# EasyEDA Pro project ESC-Player_BackBoardV03.epro

# Schematic Schematic1_2
Board Name: BackBoardV03; Create Date: 2025-04-19; Page Name: P1; Project Name: PcpRpi; Schematic Name: Schematic1_2; Update Date: 2025-04-19; Company: 嘉立创EDA; Page Size: A4; Version: V1.0
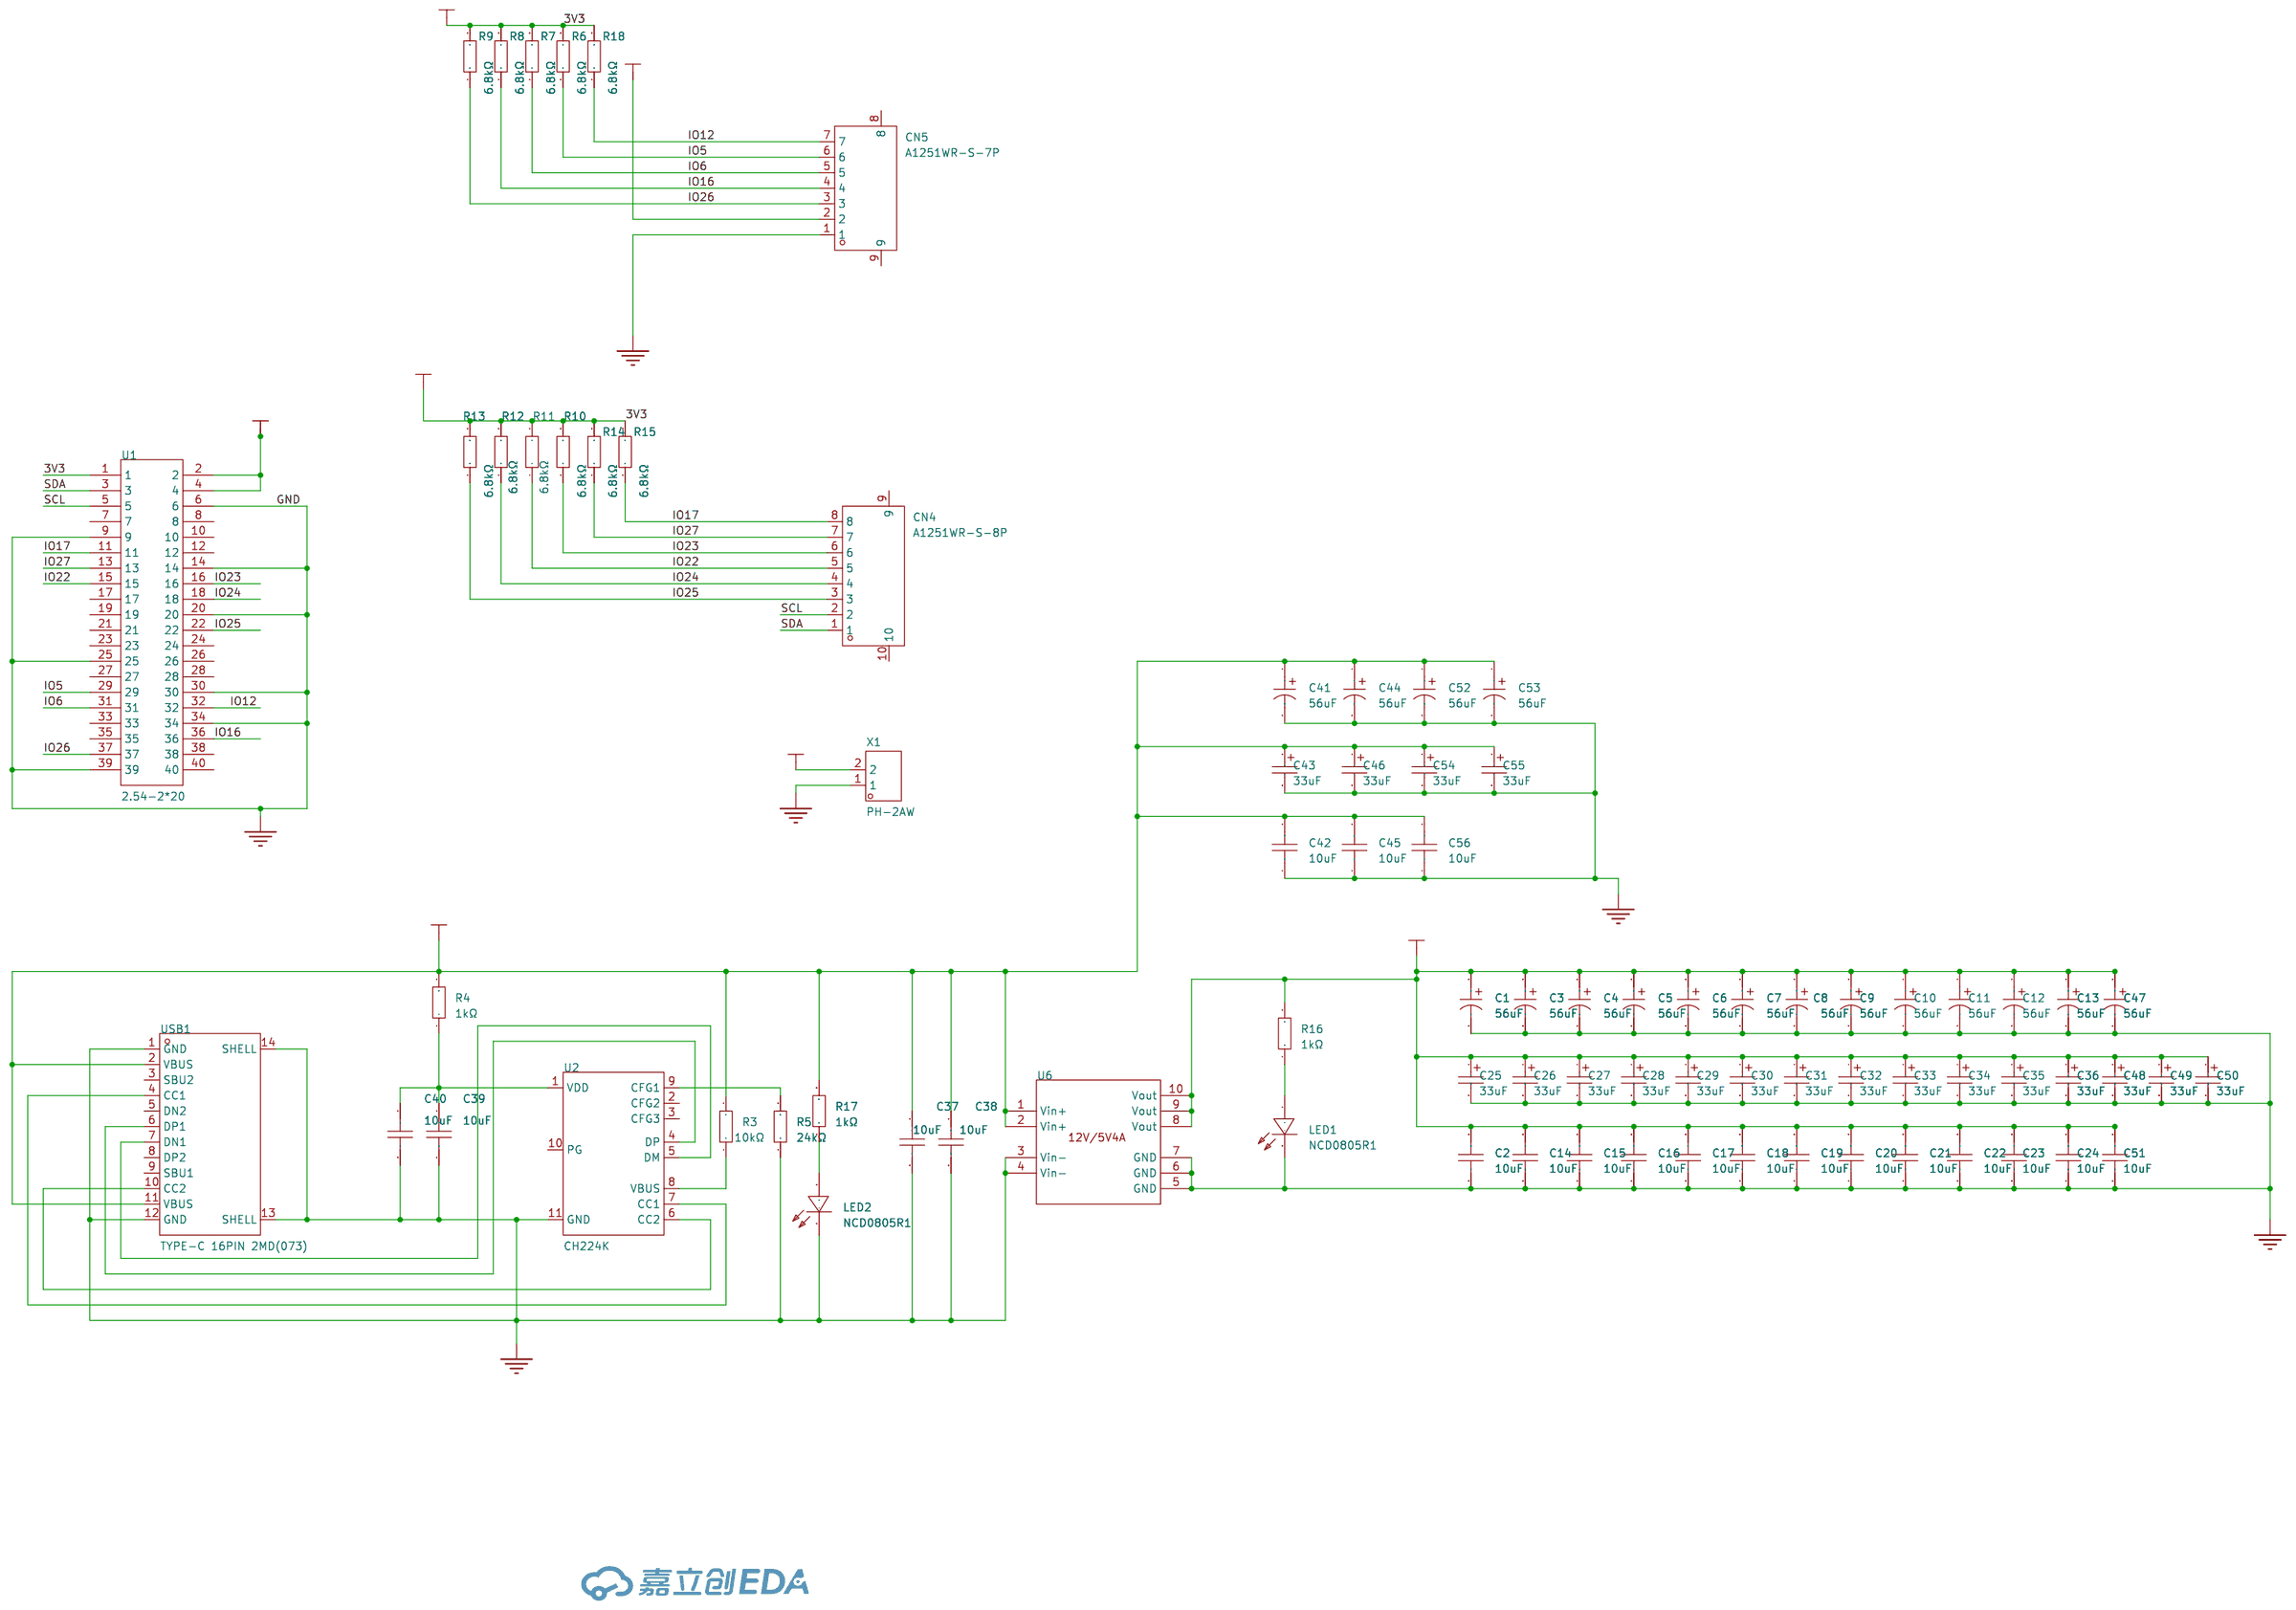
[diagram p0: schematic sheet]

## Parts
C1  56uF  [CAP-SMD_BD6.3-L6.6-W6.6-LS7.2-FD]
C2  10uF  [C1206]
C3  56uF  [CAP-SMD_BD6.3-L6.6-W6.6-LS7.2-FD]
C4  56uF  [CAP-SMD_BD6.3-L6.6-W6.6-LS7.2-FD]
C5  56uF  [CAP-SMD_BD6.3-L6.6-W6.6-LS7.2-FD]
C6  56uF  [CAP-SMD_BD6.3-L6.6-W6.6-LS7.2-FD]
C7  56uF  [CAP-SMD_BD6.3-L6.6-W6.6-LS7.2-FD]
C8  56uF  [CAP-SMD_BD6.3-L6.6-W6.6-LS7.2-FD]
C9  56uF  [CAP-SMD_BD6.3-L6.6-W6.6-LS7.2-FD]
C10  56uF  [CAP-SMD_BD6.3-L6.6-W6.6-LS7.2-FD]
C11  56uF  [CAP-SMD_BD6.3-L6.6-W6.6-LS7.2-FD]
C12  56uF  [CAP-SMD_BD6.3-L6.6-W6.6-LS7.2-FD]
C13  56uF  [CAP-SMD_BD6.3-L6.6-W6.6-LS7.2-FD]
C14  10uF  [C1206]
C15  10uF  [C1206]
C16  10uF  [C1206]
C17  10uF  [C1206]
C18  10uF  [C1206]
C19  10uF  [C1206]
C20  10uF  [C1206]
C21  10uF  [C1206]
C22  10uF  [C1206]
C23  10uF  [C1206]
C24  10uF  [C1206]
C25  33uF  [CAP-SMD_L3.5-W2.8-R-RD]
C26  33uF  [CAP-SMD_L3.5-W2.8-R-RD]
C27  33uF  [CAP-SMD_L3.5-W2.8-R-RD]
C28  33uF  [CAP-SMD_L3.5-W2.8-R-RD]
C29  33uF  [CAP-SMD_L3.5-W2.8-R-RD]
C30  33uF  [CAP-SMD_L3.5-W2.8-R-RD]
C31  33uF  [CAP-SMD_L3.5-W2.8-R-RD]
C32  33uF  [CAP-SMD_L3.5-W2.8-R-RD]
C33  33uF  [CAP-SMD_L3.5-W2.8-R-RD]
C34  33uF  [CAP-SMD_L3.5-W2.8-R-RD]
C35  33uF  [CAP-SMD_L3.5-W2.8-R-RD]
C36  33uF  [CAP-SMD_L3.5-W2.8-R-RD]
C37  10uF  [C0805]
C38  10uF  [C0805]
C39  10uF  [C0805]
C40  10uF  [C0805]
C41  56uF  [CAP-SMD_BD6.3-L6.6-W6.6-LS7.2-FD]
C42  10uF  [C1206]
C43  33uF  [CAP-SMD_L3.5-W2.8-R-RD]
C44  56uF  [CAP-SMD_BD6.3-L6.6-W6.6-LS7.2-FD]
C45  10uF  [C1206]
C46  33uF  [CAP-SMD_L3.5-W2.8-R-RD]
C47  56uF  [CAP-SMD_BD6.3-L6.6-W6.6-LS7.2-FD]
C48  33uF  [CAP-SMD_L3.5-W2.8-R-RD]
C49  33uF  [CAP-SMD_L3.5-W2.8-R-RD]
C50  33uF  [CAP-SMD_L3.5-W2.8-R-RD]
C51  10uF  [C1206]
C52  56uF  [CAP-SMD_BD6.3-L6.6-W6.6-LS7.2-FD]
C53  56uF  [CAP-SMD_BD6.3-L6.6-W6.6-LS7.2-FD]
C54  33uF  [CAP-SMD_L3.5-W2.8-R-RD]
C55  33uF  [CAP-SMD_L3.5-W2.8-R-RD]
C56  10uF  [C1206]
CN4  A1251WR-S-8P  [CONN-SMD_A1251WR-S-8P]
CN5  A1251WR-S-7P  [CONN-SMD_A1251WR-S-7P]
LED1  NCD0805R1  [LED0805-R-RD]
LED2  NCD0805R1  [LED0805-R-RD]
R3  10kΩ  [R0805]
R4  1kΩ  [R0805]
R5  24kΩ  [R0805]
R6  6.8kΩ  [R0805]
R7  6.8kΩ  [R0805]
R8  6.8kΩ  [R0805]
R9  6.8kΩ  [R0805]
R10  6.8kΩ  [R0805]
R11  6.8kΩ  [R0805]
R12  6.8kΩ  [R0805]
R13  6.8kΩ  [R0805]
R14  6.8kΩ  [R0805]
R15  6.8kΩ  [R0805]
R16  1kΩ  [R0805]
R17  1kΩ  [R0805]
R18  6.8kΩ  [R0805]
U1  2.54-2*20  [HDR-TH_40P-P2.54-V-F-R2-C20-S2.54]
U2  CH224K  [ESSOP-10_L4.9-W3.9-P1.0-LS6.0-TL-EP]
U6  -  [dcdc]
USB1  TYPE-C 16PIN 2MD(073)  [USB-C-SMD_TYPE-C-6PIN-2MD-073]
X1  PH-2AW  [CONN-TH_2P-P2.00_PH-2AW]

## Library data of the parts
C1 C3-C13 C41 C44 C47 C52 C53 = HBW560M1ETR-0606: 容值:56uF;精度:±20%;额定电压:25V;; LCSC Part Name: 56uF ±20% 25V; Supplier Part: C3031601; Manufacturer: lelon(立隆); Supplier Footprint: SMD,D6.3xL5.8mm; JLCPCB Part Class: 扩展库; Datasheet: https://atta.szlcsc.com/upload/public/pdf/source/20220826/86BC00B1F6AA3761D44833E7B51BBBC0.pdf; Supplier: LCSC; Tolerance: ±20%; Voltage Rated: 25V
C2 C14-C24 C42 C45 C51 C56 = HGC1206R5106K500NSPJ: 容值:10uF;精度:±10%;额定电压:50V;材质(温度系数):X5R;; LCSC Part Name: 10uF ±10% 50V; Supplier Part: C7432781; Manufacturer: Chinocera(华瓷); Supplier Footprint: 1206; JLCPCB Part Class: 扩展库; Datasheet: https://atta.szlcsc.com/upload/public/pdf/source/20240320/FAC3FEC40A78BC5CCCE96C232A94D860.pdf; Supplier: LCSC; Tolerance: ±10%; Voltage Rated: 50V; Temperature Coefficient: X5R
C25-C36 C43 C46 C48-C50 C54 C55 = TAJB336K016RNJ: 容值:33uF;精度:±10%;额定电压:16V;等效串联电阻:2.1Ω@100kHz;; LCSC Part Name: 33uF ±10% 16V; Supplier Part: C7203; Manufacturer: Kyocera AVX; Supplier Footprint: CASE-B-3528; JLCPCB Part Class: 扩展库; Datasheet: https://atta.szlcsc.com/upload/public/pdf/source/20160107/1457707750344.pdf; Supplier: LCSC; Tolerance: ±10%; Rated Voltage: 16V; Equivalent Series Resistance(ESR): 2.1Ω@100kHz; Operating Temperature: -55℃~+125℃
C37-C40 = CL21A106KQFNNNE: 温度系数:X5R;额定电压:6.3V;精度:±10%;容值:10uF;; LCSC Part Name: 10uF(106) ±10% 6.3V; Supplier Part: C307525; Manufacturer: SAMSUNG(三星); Supplier Footprint: 0805; JLCPCB Part Class: Extended Part; Datasheet: https://atta.szlcsc.com/upload/public/pdf/source/20181009/C307525_56F628E2031BE35DC1A6FC1BF9D3FDBB.pdf; Supplier: LCSC; Temperature Coefficient: X5R; Voltage Rated: 6.3V; Tolerance: ±10%
CN4 = A1251WR-S-8P: 参考系列:-;间距:1.25mm;插针结构:1x8P;排数:1;每排PIN数:8;行距:-;安装方式:-;触头材质:磷青铜;; LCSC Part Name: MX1.25卧式贴片 镀锡 8P 针座连接器 镀锡; Supplier Part: C225117; Manufacturer: CJT(长江连接器); Supplier Footprint: SMD,P=1.25mm; JLCPCB Part Class: Extended Part; Datasheet: https://atta.szlcsc.com/upload/public/pdf/source/20180509/C225117_D5F4D71799B1C48B3D2F530BDEB28181.pdf; Supplier: LCSC; Pitch: 1.25mm; Pins Structure: 1x8P; Number of Rows: 1; Number of PINs Per Row: 8; Contact Material: 磷青铜
CN5 = A1251WR-S-7P: 参考系列:-;间距:1.25mm;插针结构:1x7P;排数:1;每排PIN数:7;行距:-;安装方式:-;触头材质:磷青铜;; LCSC Part Name: MX1.25卧式贴片 镀锡 7P 针座连接器; Supplier Part: C225116; Manufacturer: CJT(长江连接器); Supplier Footprint: SMD,P=1.25mm; JLCPCB Part Class: Extended Part; Datasheet: https://atta.szlcsc.com/upload/public/pdf/source/20180509/C225116_1193194061237BAC0FC2FBD9C148EEA9.pdf; Supplier: LCSC; Pitch: 1.25mm; Pins Structure: 1x7P; Number of Rows: 1; Number of PINs Per Row: 7; Contact Material: 磷青铜
LED1 LED2 = NCD0805R1: 灯头类型:-;发光颜色:红色;正向电压(VF):1.6V~2.6V;功率:65mW;正向电流:20mA;主波长:615nm~630nm;二极管配置:独立二极管;透镜颜色:无色透明透镜;色温:-;发光强度:67mcd~195mcd;发光角度:130°;载带方式:-;工作温度:-30℃~+85℃;; Supplier Part: C84256; Manufacturer: 国星光电; Supplier Footprint: 0805; JLCPCB Part Class: Basic Part; Datasheet: https://atta.szlcsc.com/upload/public/pdf/source/20200820/C84256_F0A75A43B3EAD75808600A0514C76B99.pdf; Supplier: LCSC; Emitted Color: 红色; Forward Voltage (VF): 1.6V~2.6V; Power Dissipation: 65mW; Forward Current: 20mA; Dominant Wavelength: 615nm~630nm; Diode Configuration: 独立二极管; Lens Color: 无色透明透镜; Luminous Intensity: 67mcd~195mcd; Viewing Angle: 130°; Operating Temperature: -30℃~+85℃
R3 = 0805W8F1002T5E_C17414: 电阻类型:厚膜电阻;阻值:10kΩ;精度:±1%;功率:125mW;最大工作电压:150V;温度系数:±100ppm/℃;; LCSC Part Name: 10kΩ ±1% 125mW 厚膜电阻; Supplier Part: C17414; Manufacturer: UNI-ROYAL(厚声); Manufacturer Part: 0805W8F1002T5E; Supplier Footprint: 0805; JLCPCB Part Class: 基础库; Datasheet: https://atta.szlcsc.com/upload/public/pdf/source/20200306/C422600_1E6D84923E4A46A82E41ADD87F860B5C.pdf; Supplier: LCSC; Type: 厚膜电阻; Tolerance: ±1%; Power(Watts): 125mW; Overload Voltage (Max): 150V; Temperature Coefficient: ±100ppm/℃; Operating Temperature Range: -55℃~+155℃
R4 R16 R17 = 0805W8F1001T5E: 电阻类型:厚膜电阻;阻值:1kΩ;精度:±1%;功率:125mW;最大工作电压:150V;温度系数:±100ppm/℃;; LCSC Part Name: 1kΩ ±1% 125mW 厚膜电阻; Supplier Part: C17513; Manufacturer: UNI-ROYAL(厚声); Supplier Footprint: 0805; JLCPCB Part Class: 基础库; Datasheet: https://atta.szlcsc.com/upload/public/pdf/source/20200306/C422600_1E6D84923E4A46A82E41ADD87F860B5C.pdf; Supplier: LCSC; Type: 厚膜电阻; Tolerance: ±1%; Power(Watts): 125mW; Overload Voltage (Max): 150V; Temperature Coefficient: ±100ppm/℃; Operating Temperature Range: -55℃~+155℃
R5-R15 R18 = 0805W8F6801T5E: 电阻类型:厚膜电阻;阻值:6.8kΩ;精度:±1%;功率:125mW;最大工作电压:150V;温度系数:±100ppm/℃;; LCSC Part Name: 6.8kΩ ±1% 125mW 厚膜电阻; Supplier Part: C17772; Manufacturer: UNI-ROYAL(厚声); Supplier Footprint: 0805; JLCPCB Part Class: Basic Part; Datasheet: https://atta.szlcsc.com/upload/public/pdf/source/20200306/C422600_1E6D84923E4A46A82E41ADD87F860B5C.pdf; Supplier: LCSC; Type: 厚膜电阻; Tolerance: ±1%; Power(Watts): 125mW; Overload Voltage (Max): 150V; Temperature Coefficient: ±100ppm/℃; Operating Temperature Range: -55℃~+155℃
U1 = 2.54-2*20: 插孔结构:2x20P;间距:2.54mm;行距:2.54mm;圆孔/方孔:方孔;安装类型:直插;排数:双排;总孔位数:40P;额定电流:2.5A;额定电压:-;插孔方向:顶部;塑高:8.5mm;工作温度范围:-40℃~+105℃;; LCSC Part Name: 间距:2.54mm 2x20P 直插; Supplier Part: C2977589; Manufacturer: ZHOURI(洲日); Supplier Footprint: 插件,P=2.54mm; JLCPCB Part Class: 扩展库; Datasheet: https://atta.szlcsc.com/upload/public/pdf/source/20220328/834E302BE3C038BBC5C70F5E02589B1E.pdf; Supplier: LCSC; Holes Structure: 2x20P; Pitch: 2.54mm; Row Spacing: 2.54mm; Circular Hole / Square Hole: 方孔; Mounting Type: 直插; Number of Rows: 双排; Number of Holes: 40P; Current Rating (Max): 2.5A; Holes Direction: 顶部; Insulation Height: 8.5mm; Operating Temperature Range: -40℃~+105℃
U2 = CH224K: LCSC Part Name: USBPD等多快充协议受电芯片CH224; Supplier Part: C970725; Manufacturer: WCH(南京沁恒); Supplier Footprint: ESSOP-10-150mil-1mm; JLCPCB Part Class: 扩展库; Datasheet: https://atta.szlcsc.com/upload/public/pdf/source/20240313/43C2AFDDBDD1F65B60386D2CCAB0811B.pdf; Supplier: LCSC
U6 = WSDCDC
USB1 = TYPE-C 16PIN 2MD(073): 连接器类型:Type-C;标准:USB 3.1;公母:母;安装方式:卧贴;触点数量:16P;端口数量:1;额定电流 - 电源:5A;工作温度范围:-25℃~+85℃;; LCSC Part Name: Type-C 母 卧贴; Supplier Part: C2765186; Manufacturer: SHOU HAN(首韩); Supplier Footprint: SMD; JLCPCB Part Class: 扩展库; Datasheet: https://atta.szlcsc.com/upload/public/pdf/source/20211123/39B17C16241EAC15C5E277BDA434118E.pdf; Supplier: LCSC; Connector Type: Type-C; Standard: USB 3.1; Gender: 母; Mounting Style: 卧贴; Number of Contacts: 16P; Number of Ports: 1; Current Rating - Power (Max): 5A; Operating Temperature Range: -25℃~+85℃; Rated Voltage (Max): 5V; Connect-Disconnect Life: 5千次; Core Colour: 黑色
X1 = PH-2AW: 参考系列:PH;间距:2mm;插针结构:1x2P;排数:1;每排PIN数:2;行距:-;安装方式:-;触头材质:-;; LCSC Part Name: PH-2AW 2P 脚距2.0mm 卧插; Supplier Part: C16965; Manufacturer: BOOMELE(博穆精密); Supplier Footprint: 插件,P=2mm; JLCPCB Part Class: Extended Part; Datasheet: https://atta.szlcsc.com/upload/public/pdf/source/20151118/1457707578512.pdf; Supplier: LCSC; Reference Series: PH; Pitch: 2mm; Pins Structure: 1x2P; Number of Rows: 1; Number of PINs Per Row: 2

## Nets
3V3: R6.2 R7.2 R8.2 R9.2 R10.2 R11.2 R12.2 R13.2 R14.2 R15.2 R18.2 U1.1
5V: C1.1 C2.2 C3.1 C4.1 C5.1 C6.1 C7.1 C8.1 C9.1 C10.1 C11.1 C12.1 C13.1 C14.2 C15.2 C16.2 C17.2 C18.2 C19.2 C20.2 C21.2 C22.2 C23.2 C24.2 C25.1 C26.1 C27.1 C28.1 C29.1 C30.1 C31.1 C32.1 C33.1 C34.1 C35.1 C36.1 C47.1 C48.1 C49.1 C50.1 C51.2 CN5.2 R16.2 U1.2 U1.4 U6.8(Vout) U6.9(Vout) U6.10(Vout)
GND: C1.2 C2.1 C3.2 C4.2 C5.2 C6.2 C7.2 C8.2 C9.2 C10.2 C11.2 C12.2 C13.2 C14.1 C15.1 C16.1 C17.1 C18.1 C19.1 C20.1 C21.1 C22.1 C23.1 C24.1 C25.2 C26.2 C27.2 C28.2 C29.2 C30.2 C31.2 C32.2 C33.2 C34.2 C35.2 C36.2 C37.2 C38.2 C39.2 C40.2 C41.2 C42.1 C43.2 C44.2 C45.1 C46.2 C47.2 C48.2 C49.2 C50.2 C51.1 C52.2 C53.2 C54.2 C55.2 C56.1 CN5.1 LED1.2(-) LED2.2(-) R5.1 U1.6 U1.9 U1.14 U1.20 U1.25 U1.30 U1.34 U1.39 U2.11(GND) U6.3(Vin-) U6.4(Vin-) U6.5(GND) U6.6(GND) U6.7(GND) USB1.1(GND) USB1.12(GND) USB1.13(SHELL) USB1.14(SHELL) X1.1
VBUS: C37.1 C38.1 C41.1 C42.2 C43.1 C44.1 C45.2 C46.1 C52.1 C53.1 C54.1 C55.1 C56.2 R3.2 R4.2 R17.2 U6.1(Vin+) U6.2(Vin+) USB1.2(VBUS) USB1.11(VBUS) X1.2
IO5: CN5.6 R6.1 U1.29
IO6: CN5.5 R7.1 U1.31
IO12: CN5.7 R18.1 U1.32
IO16: CN5.4 R8.1 U1.36
IO17: CN4.8 R15.1 U1.11
IO22: CN4.5 R11.1 U1.15
IO23: CN4.6 R10.1 U1.16
IO24: CN4.4 R12.1 U1.18
IO25: CN4.3 R13.1 U1.22
IO26: CN5.3 R9.1 U1.37
IO27: CN4.7 R14.1 U1.13
SCL: CN4.2 U1.5
SDA: CN4.1 U1.3
$1N3108: C39.1 C40.1 R4.1 U2.1(VDD)
$1N3157: U2.6(CC2) USB1.10(CC2)
$1N3186: R3.1 U2.8(VBUS)
$1N3548: R5.2 U2.9(CFG1)
$1N3577: U2.4(DP) USB1.6(DP1)
$1N10235: LED1.1(+) R16.1
$1N10369: LED2.1(+) R17.1
$1N10886: U2.7(CC1) USB1.4(CC1)
$1N10969: U2.5(DM) USB1.7(DN1)

Not connected (* = marked no-connect by the designer): CN4 9 10; CN5 8 9; U1 7 8 10 12 17 19 21 23 24 26 27 28 33 35 38 40; U2 2(CFG2) 3(CFG3) 10(PG); USB1 3(SBU2) 5(DN2) 8(DP2) 9(SBU1)

# Board PCB1_2
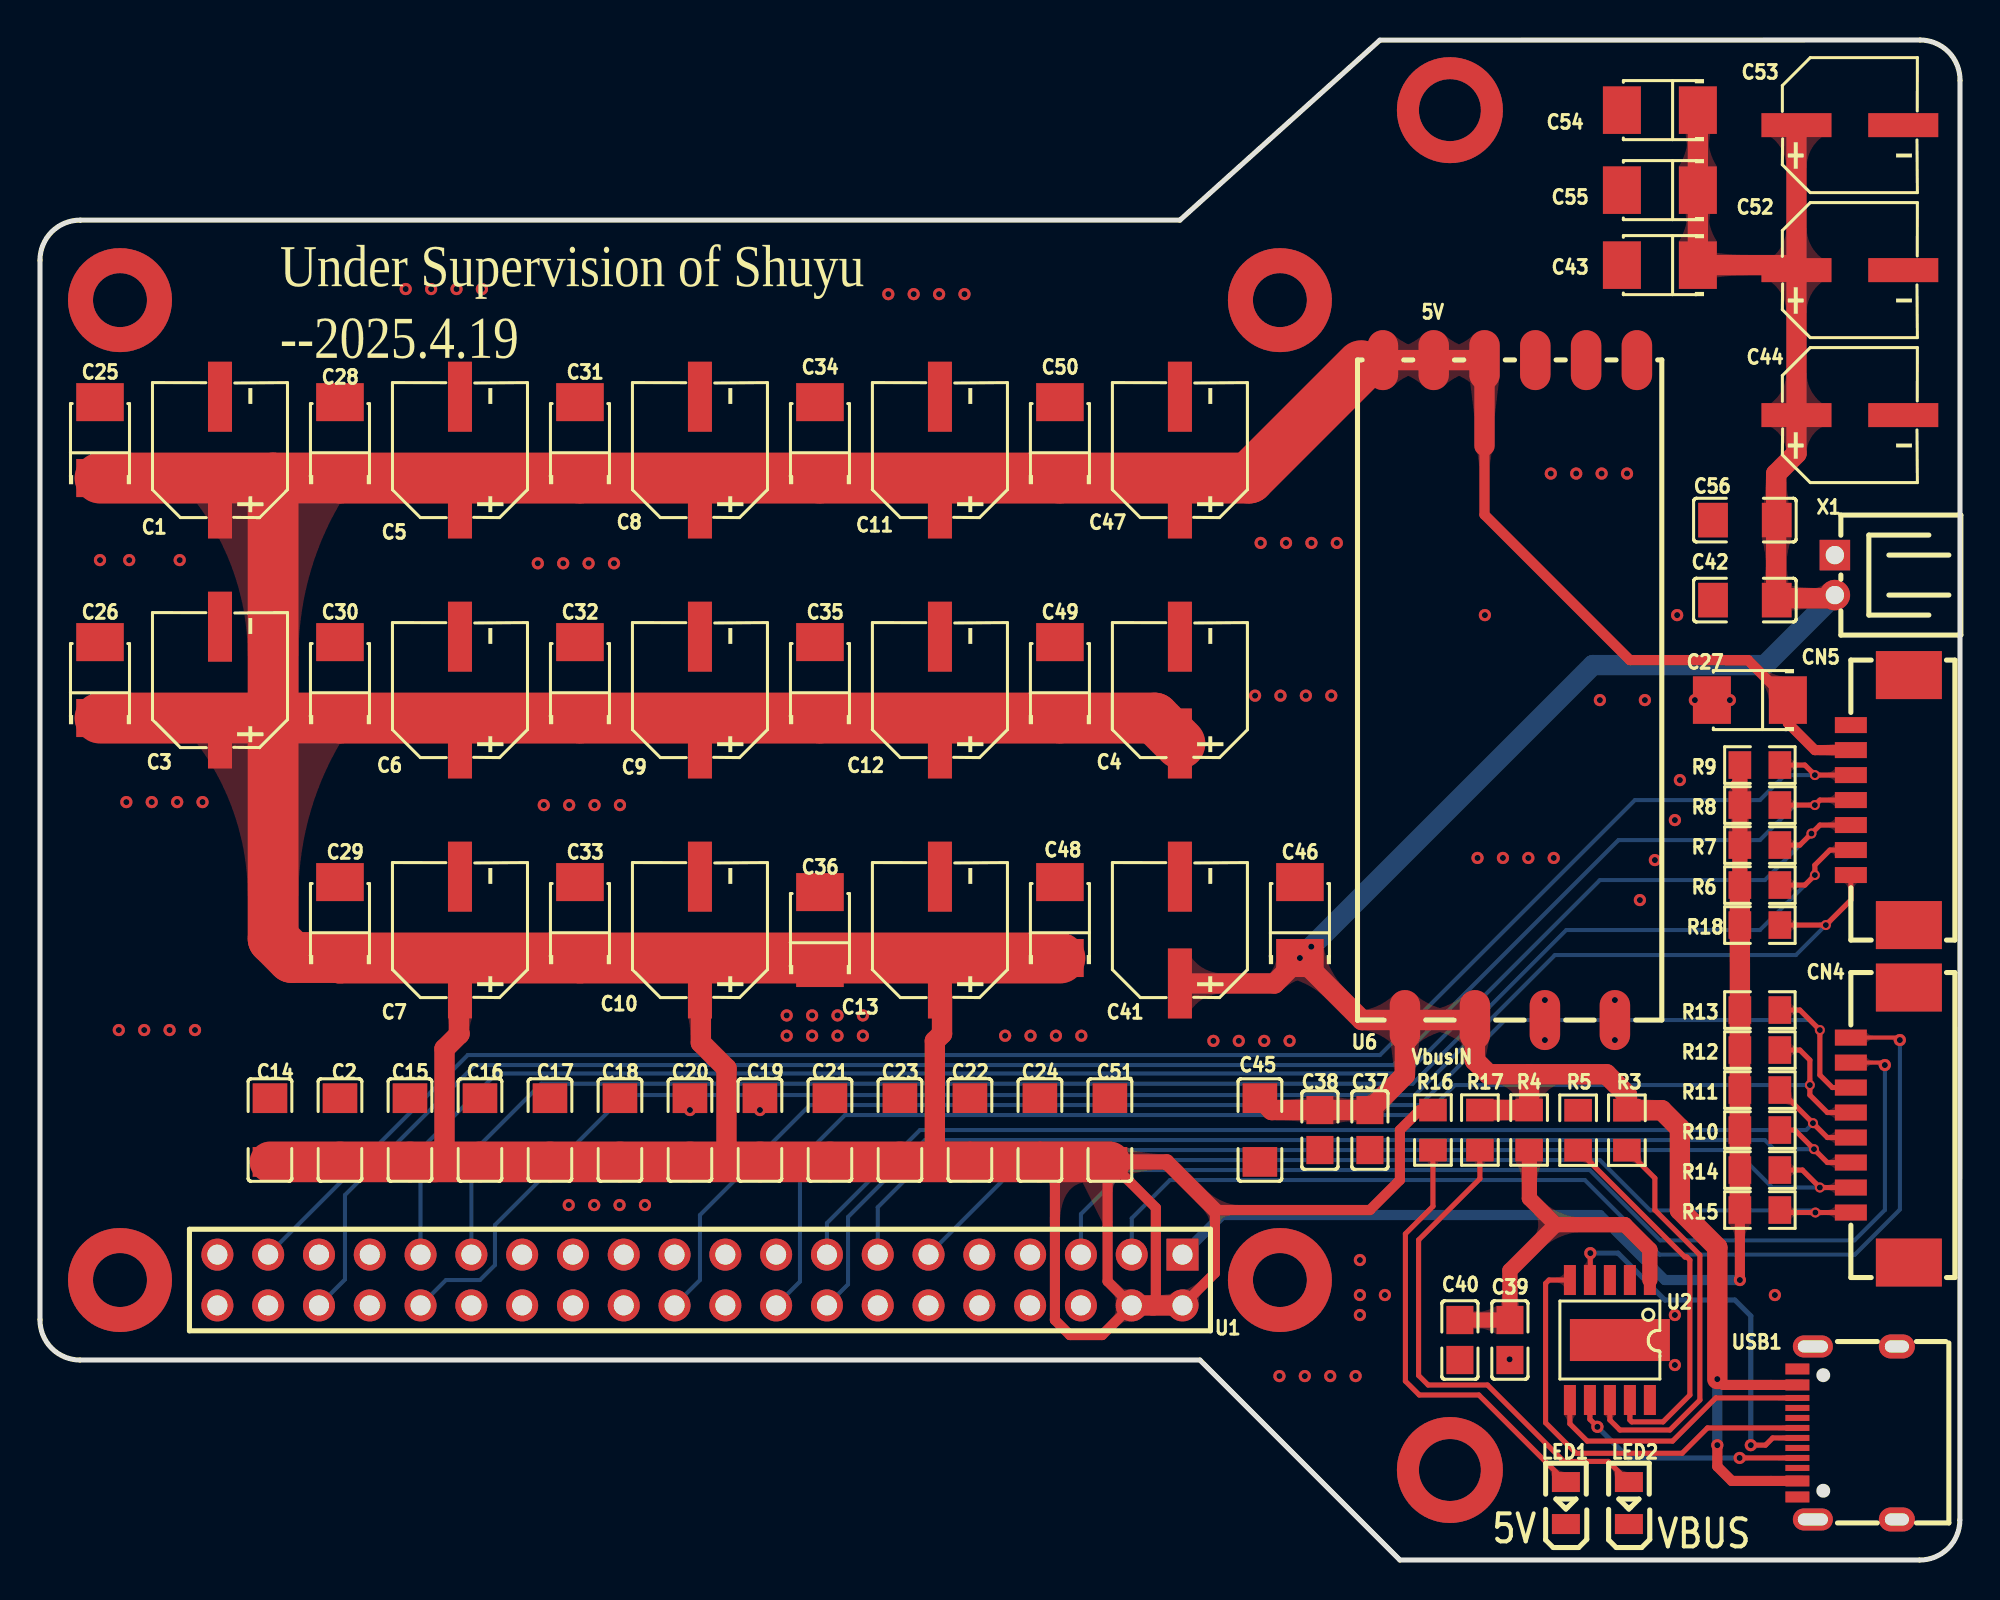
[diagram p1: board, top side]
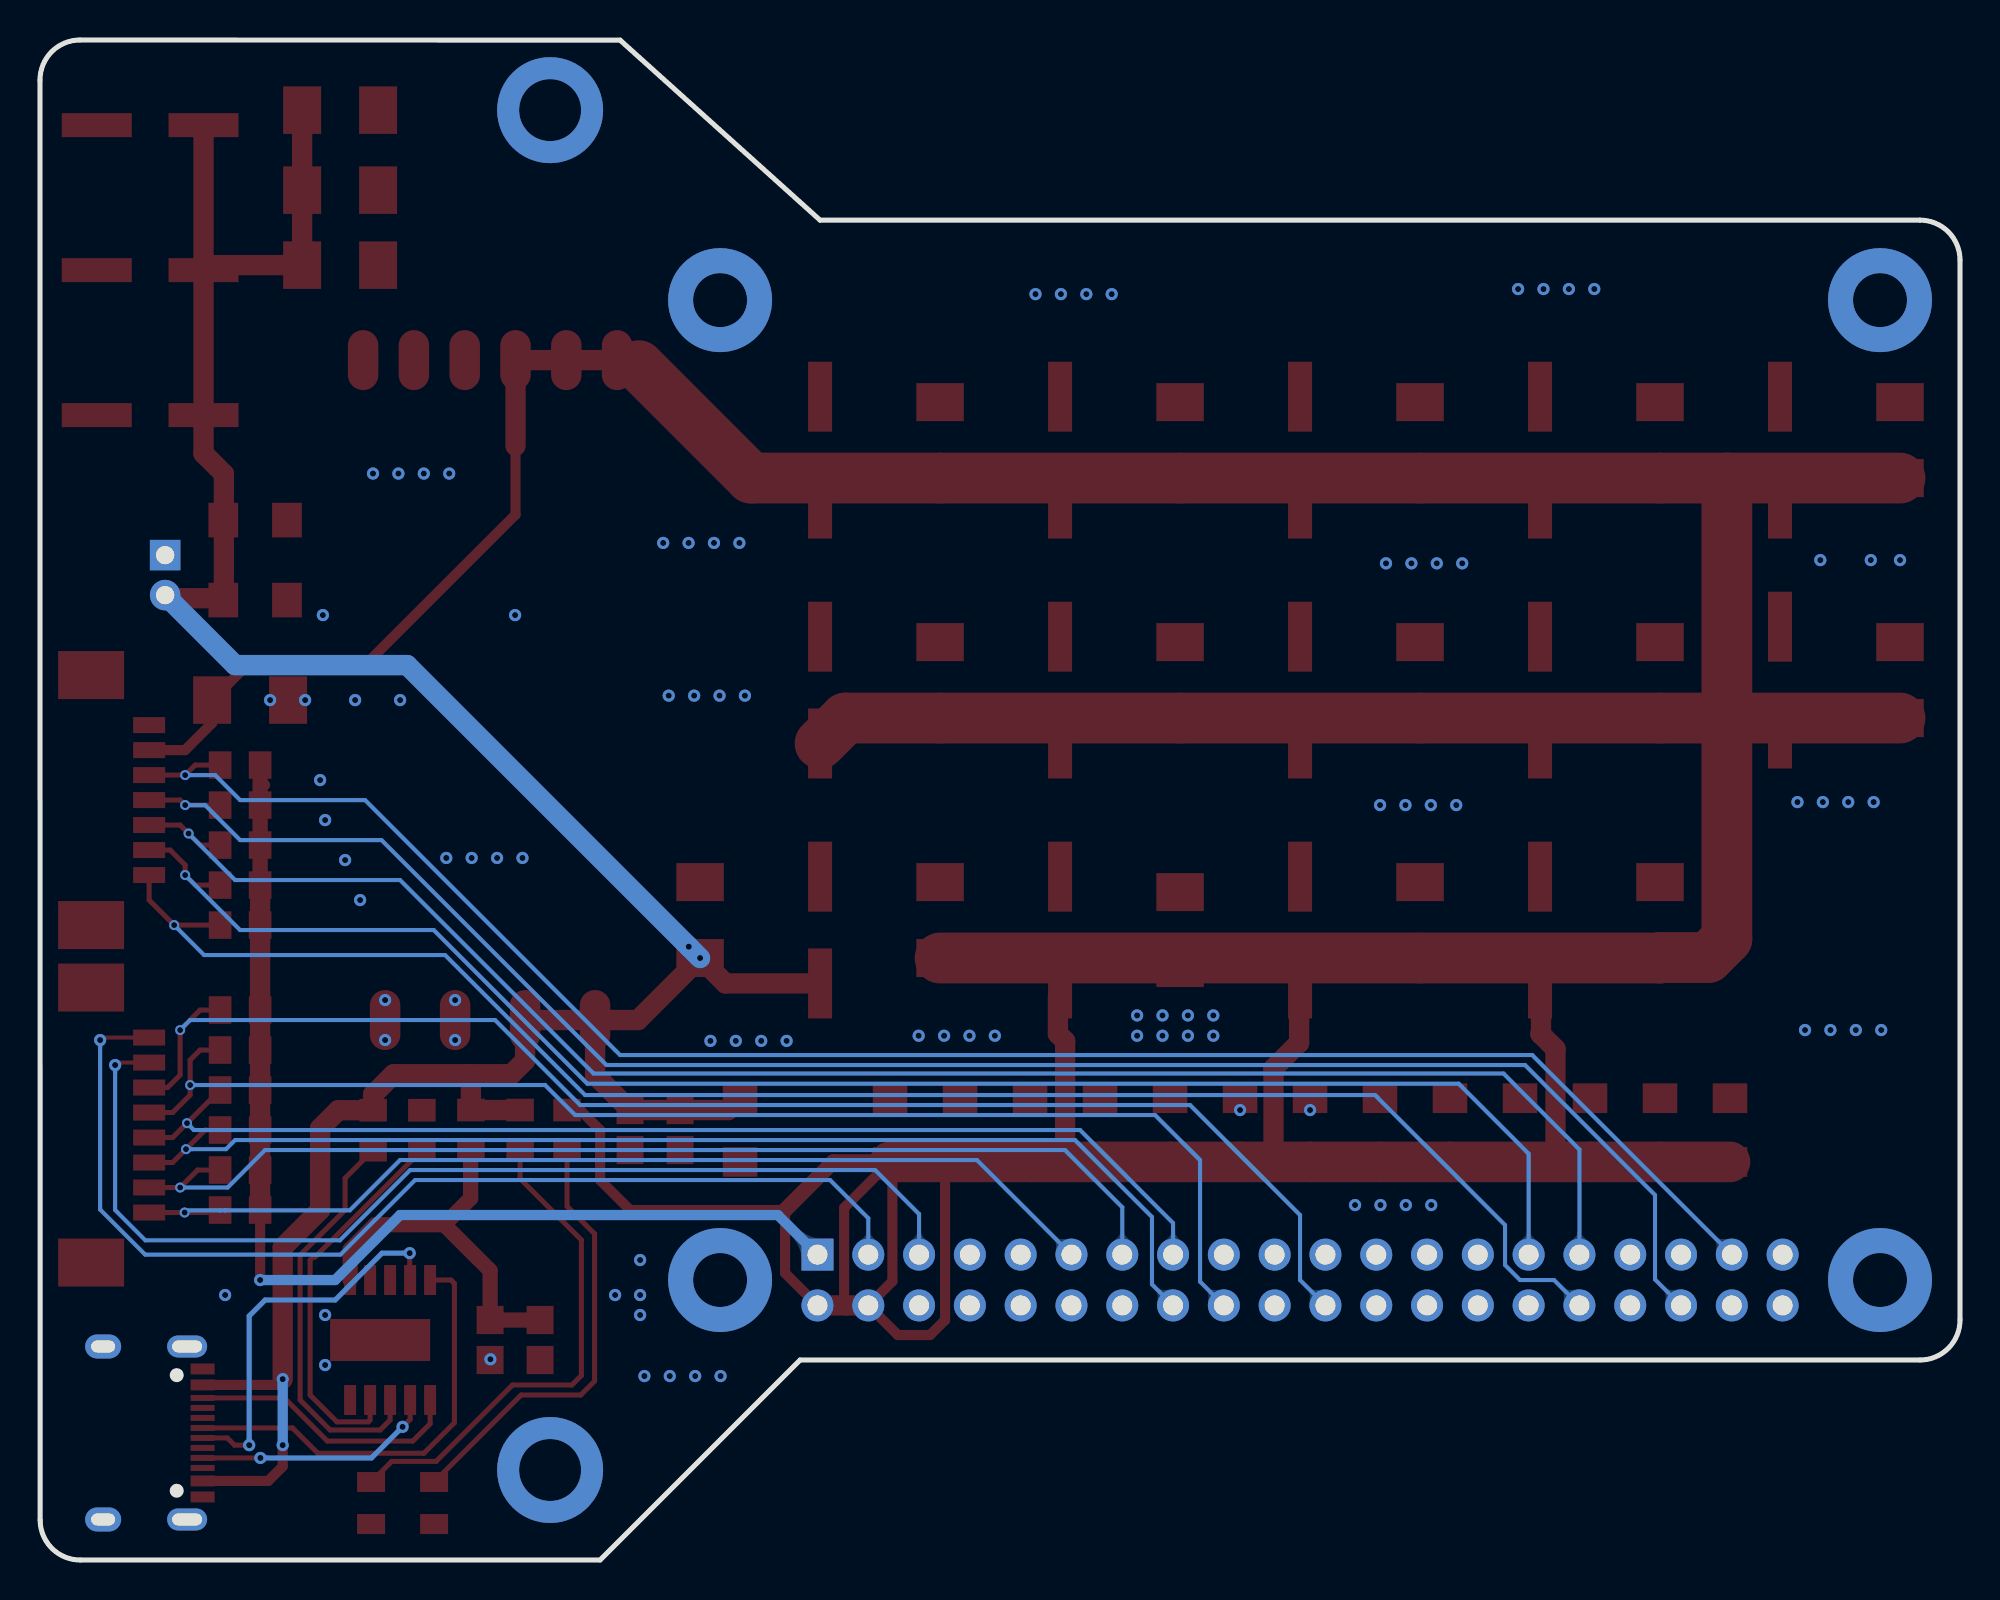
[diagram p2: board, bottom side, seen from below]

Outline 96.01 x 76.01 mm; copper layers: Top Layer, Bottom Layer. Coordinates in mm from the lower left corner of the outline.
Outline path: 0,65 arc(0.59,66.42) 2.01,67 57,67 67,76 94.01,76.01 arc(95.43,75.42) 96.01,73.99 96,2 arc(95.41,0.58) 93.99,0 68,0 58,10 2,10 arc(0.58,10.59) 0,12.01 0,65
Stack: Top Layer 0.035mm / Dielectric1 1.51mm FR4 er 4.5 / Bottom Layer 0.035mm

## Design rules (mm)
template: 自定义配置
spacing copperThickness1oz (default): track to track 0.102, other pairs 0.152 to 0.3
spacing copperThickness2oz: track to track 0.203, other pairs 0.152 to 0.3
track width copperThickness1oz (default): min 0.127, default 0.254, max 2.54
track width copperThickness2oz: min 0.203, default 0.254, max 2.54
track width PWR: min 0.508, default 1.016, max 2.54
differential pair differentialPair (default): width min 0.127, default 0.254, max 2.54; gap min 0.152, default 0.152
via viaSize (default): diameter min 0.5, default 0.61, max 10; hole min 0.3, default 0.305, max 6.299
net 5V uses PWR
net VBUS uses PWR
net 3V3 uses PWR

## Placement (name value [footprint] x y rotation side)
C1  56uF  [CAP-SMD_BD6.3-L6.6-W6.6-LS7.2-FD]  9 55.5 90 top
C2  10uF  [C1206]  15 21.5 270 top
C3  56uF  [CAP-SMD_BD6.3-L6.6-W6.6-LS7.2-FD]  9 44 90 top
C4  56uF  [CAP-SMD_BD6.3-L6.6-W6.6-LS7.2-FD]  57 43.5 90 top
C5  56uF  [CAP-SMD_BD6.3-L6.6-W6.6-LS7.2-FD]  21 55.5 90 top
C6  56uF  [CAP-SMD_BD6.3-L6.6-W6.6-LS7.2-FD]  21 43.5 90 top
C7  56uF  [CAP-SMD_BD6.3-L6.6-W6.6-LS7.2-FD]  21 31.5 90 top
C8  56uF  [CAP-SMD_BD6.3-L6.6-W6.6-LS7.2-FD]  33 55.5 90 top
C9  56uF  [CAP-SMD_BD6.3-L6.6-W6.6-LS7.2-FD]  33 43.5 90 top
C10  56uF  [CAP-SMD_BD6.3-L6.6-W6.6-LS7.2-FD]  33 31.5 90 top
C11  56uF  [CAP-SMD_BD6.3-L6.6-W6.6-LS7.2-FD]  45 55.5 90 top
C12  56uF  [CAP-SMD_BD6.3-L6.6-W6.6-LS7.2-FD]  45 43.5 90 top
C13  56uF  [CAP-SMD_BD6.3-L6.6-W6.6-LS7.2-FD]  45 31.5 90 top
C14  10uF  [C1206]  11.5 21.5 270 top
C15  10uF  [C1206]  18.5 21.5 270 top
C16  10uF  [C1206]  22 21.5 270 top
C17  10uF  [C1206]  25.5 21.5 270 top
C18  10uF  [C1206]  29 21.5 270 top
C19  10uF  [C1206]  36 21.5 270 top
C20  10uF  [C1206]  32.5 21.5 270 top
C21  10uF  [C1206]  39.5 21.5 270 top
C22  10uF  [C1206]  46.5 21.5 270 top
C23  10uF  [C1206]  43 21.5 270 top
C24  10uF  [C1206]  50 21.5 270 top
C25  33uF  [CAP-SMD_L3.5-W2.8-R-RD]  3 56 270 top
C26  33uF  [CAP-SMD_L3.5-W2.8-R-RD]  3 44 270 top
C27  33uF  [CAP-SMD_L3.5-W2.8-R-RD]  85.5 43 0 top
C28  33uF  [CAP-SMD_L3.5-W2.8-R-RD]  15 56 270 top
C29  33uF  [CAP-SMD_L3.5-W2.8-R-RD]  15 32 270 top
C30  33uF  [CAP-SMD_L3.5-W2.8-R-RD]  15 44 270 top
C31  33uF  [CAP-SMD_L3.5-W2.8-R-RD]  27 56 270 top
C32  33uF  [CAP-SMD_L3.5-W2.8-R-RD]  27 44 270 top
C33  33uF  [CAP-SMD_L3.5-W2.8-R-RD]  27 32 270 top
C34  33uF  [CAP-SMD_L3.5-W2.8-R-RD]  39 56 270 top
C35  33uF  [CAP-SMD_L3.5-W2.8-R-RD]  39 44 270 top
C36  33uF  [CAP-SMD_L3.5-W2.8-R-RD]  39 31.5 270 top
C37  10uF  [C0805]  66.5 21.5 270 top
C38  10uF  [C0805]  64 21.5 270 top
C39  10uF  [C0805]  73.5 11 270 top
C40  10uF  [C0805]  71 11 270 top
C41  56uF  [CAP-SMD_BD6.3-L6.6-W6.6-LS7.2-FD]  57 31.5 90 top
C42  10uF  [C1206]  85.25 48 0 top
C43  33uF  [CAP-SMD_L3.5-W2.8-R-RD]  81 64.75 0 top
C44  56uF  [CAP-SMD_BD6.3-L6.6-W6.6-LS7.2-FD]  90.5 57.25 0 top
C45  10uF  [C1206]  61 21.5 90 top
C46  33uF  [CAP-SMD_L3.5-W2.8-R-RD]  63 32 270 top
C47  56uF  [CAP-SMD_BD6.3-L6.6-W6.6-LS7.2-FD]  57 55.5 90 top
C48  33uF  [CAP-SMD_L3.5-W2.8-R-RD]  51 32 270 top
C49  33uF  [CAP-SMD_L3.5-W2.8-R-RD]  51 44 270 top
C50  33uF  [CAP-SMD_L3.5-W2.8-R-RD]  51 56 270 top
C51  10uF  [C1206]  53.5 21.5 270 top
C52  56uF  [CAP-SMD_BD6.3-L6.6-W6.6-LS7.2-FD]  90.5 64.5 0 top
C53  56uF  [CAP-SMD_BD6.3-L6.6-W6.6-LS7.2-FD]  90.5 71.75 0 top
C54  33uF  [CAP-SMD_L3.5-W2.8-R-RD]  81 72.5 0 top
C55  33uF  [CAP-SMD_L3.5-W2.8-R-RD]  81 68.5 0 top
C56  10uF  [C1206]  85.25 52 0 top
CN4  A1251WR-S-8P  [CONN-SMD_A1251WR-S-8P]  92 21.75 90 top
CN5  A1251WR-S-7P  [CONN-SMD_A1251WR-S-7P]  92 38 90 top
LED1  NCD0805R1  [LED0805-R-RD]  76.3 2.85 90 top
LED2  NCD0805R1  [LED0805-R-RD]  79.45 2.85 90 top
R3  10kΩ  [R0805]  79.35 21.49 90 top
R4  1kΩ  [R0805]  74.46 21.5 90 top
R5  24kΩ  [R0805]  76.91 21.49 270 top
R6  6.8kΩ  [R0805]  86 33.75 180 top
R7  6.8kΩ  [R0805]  86 35.75 180 top
R8  6.8kΩ  [R0805]  86 37.75 180 top
R9  6.8kΩ  [R0805]  86 39.75 180 top
R10  6.8kΩ  [R0805]  86 21.5 180 top
R11  6.8kΩ  [R0805]  86 23.5 180 top
R12  6.8kΩ  [R0805]  86 25.5 180 top
R13  6.8kΩ  [R0805]  86 27.5 180 top
R14  6.8kΩ  [R0805]  86 19.5 180 top
R15  6.8kΩ  [R0805]  86 17.5 180 top
R16  1kΩ  [R0805]  69.65 21.5 90 top
R17  1kΩ  [R0805]  72 21.5 90 top
R18  6.8kΩ  [R0805]  86 31.75 180 top
U1  2.54-2*20  [HDR-TH_40P-P2.54-V-F-R2-C20-S2.54]  33 14 180 top
U2  CH224K  [essop-10_l4.9-w3.9-p1.0-ls6.0-tl-ep]  78.5 11 180 top
U6  -  [dcdc]  73.5 43.5 90 top
USB1  TYPE-C 16PIN 2MD(073)  [usb-c-smd_type-c-6pin-2md-073]  90.47 6.35 90 top
X1  PH-2AW  [CONN-TH_2P-P2.00_PH-2AW]  89.75 49.25 270 top

## Footprints (pads in the part's own frame, mm; a bottom-side part is the same pattern mirrored in y, then rotated)
C0805
  rect 1.41x1.35 smd: 1(-1,0) 2(1,0)
C1206
  rect 1.485x1.728 smd: 1(-1.593,0) 2(1.593,0)
CAP-SMD_BD6.3-L6.6-W6.6-LS7.2-FD
  rect 3.5x1.2 smd: 1(-2.67,0) 2(2.67,0)
CAP-SMD_L3.5-W2.8-R-RD
  rect 1.9x2.376 smd: 1(1.899,0) 2(-1.899,0)
CONN-SMD_A1251WR-S-7P
  rect 0.8x1.6 smd: 1(3.749,1.45) 2(2.499,1.45) 3(1.25,1.45) 4(0,1.45) 5(-1.25,1.45) 6(-2.499,1.45) 7(-3.749,1.45)
  rect 2.401x3.3 smd: 8(-6.251,-1.45) 9(6.251,-1.45)
CONN-SMD_A1251WR-S-8P
  rect 0.8x1.6 smd: 1(4.374,1.45) 2(3.124,1.45) 3(1.875,1.45) 4(0.625,1.45) 5(-0.625,1.45) 6(-1.875,1.45) 7(-3.124,1.45) 8(-4.374,1.45)
  rect 2.401x3.3 smd: 9(-6.876,-1.45) 10(6.876,-1.45)
CONN-TH_2P-P2.00_PH-2AW
  rect 1.524x1.524 hole 0.914: 1(-1,0)
  round 1.524 hole 0.914: 2(1,0)
dcdc
  oval 3x1.524 smd: 1(-16.5,5.25) 2(-16.5,1.75) 3(-16.5,-1.75) 4(-16.5,-5.25) 5(16.5,-6.35) 6(16.5,-3.81) 7(16.5,-1.27) 8(16.5,1.27) 9(16.5,3.81) 10(16.5,6.35)
essop-10_l4.9-w3.9-p1.0-ls6.0-tl-ep
  rect 0.6x1.5 smd: 1(-2,-3) 2(-1,-3) 3(0,-3) 4(1,-3) 5(2,-3) 6(2,3) 7(1,3) 8(0,3) 9(-1,3) 10(-2,3)
  rect 5x2.1 smd: 11(-0.5,0)
HDR-TH_40P-P2.54-V-F-R2-C20-S2.54
  rect 1.6x1.6 hole 1: 1(-24.13,-1.27)
  round 1.6 hole 1: 2(-24.13,1.27) 3(-21.59,-1.27) 4(-21.59,1.27) 5(-19.05,-1.27) 6(-19.05,1.27) 7(-16.51,-1.27) 8(-16.51,1.27) 9(-13.97,-1.27) 10(-13.97,1.27) 11(-11.43,-1.27) 12(-11.43,1.27) 13(-8.89,-1.27) 14(-8.89,1.27) 15(-6.35,-1.27) 16(-6.35,1.27) 17(-3.81,-1.27) 18(-3.81,1.27) 19(-1.27,-1.27) 20(-1.27,1.27) 21(1.27,-1.27) 22(1.27,1.27) 23(3.81,-1.27) 24(3.81,1.27) 25(6.35,-1.27) 26(6.35,1.27) 27(8.89,-1.27) 28(8.89,1.27) 29(11.43,-1.27) 30(11.43,1.27) 31(13.97,-1.27) 32(13.97,1.27) 33(16.51,-1.27) 34(16.51,1.27) 35(19.05,-1.27) 36(19.05,1.27) 37(21.59,-1.27) 38(21.59,1.27) 39(24.13,-1.27) 40(24.13,1.27)
LED0805-R-RD
  rect 1x1.399 smd: 1(1.05,0) 2(-1.05,0)
R0805
  rect 1.133x1.377 smd: 1(-1,0) 2(1,0)
usb-c-smd_type-c-6pin-2md-073
  rect 0.55x1.2 smd: 1(-3.2,2.6) 2(-2.4,2.6) 11(2.4,2.6) 12(3.2,2.6)
  rect 0.3x1.2 smd: 3(-1.75,2.6) 4(-1.25,2.6) 5(-0.75,2.6) 6(-0.25,2.6) 7(0.25,2.6) 8(0.75,2.6) 9(1.25,2.6) 10(1.75,2.6)
  oval 1.1x2 hole 0.6x1.5: 13(-4.325,1.825) 14(4.325,1.825)
  oval 1.2x1.8 hole 0.6x1.2: 13(-4.325,-2.375) 14(4.325,-2.375)

## Nets
As in the schematic.

Pads without a net: CN4 9 10; CN5 8 9; U1 7 8 10 12 17 19 21 23 24 26 27 28 33 35 38 40; U2 2 3 10; USB1 3 5 8 9

## Via types
v1: diameter 5.2, hole 2.7, Top Layer to Bottom Layer, 4 vias
v2: diameter 5.3, hole 3.1, Top Layer to Bottom Layer, 2 vias
v3: diameter 0.61, hole 0.305, Top Layer to Bottom Layer, 102 vias
v4: diameter 0.5, hole 0.3, Top Layer to Bottom Layer, 11 vias

## Routing (per net, layer and track width the routed paths; a pad name or vN(x,y) marks a point on that pad's centre or on a via; arc(x,y) is an arc through that point)
3V3: length 55.4
  Top Layer w0.508: v3(85,14) 85,18 ; 84.75,38.75 85,39
  Top Layer w0.762: 85,39 R8.2 R7.2 85,33
  Top Layer w1.016: R15.2 R14.2 R10.2 R11.2 R12.2 R13.2 ; 85,28 R18.2 85,33
  Bottom Layer w0.508: v3(85,14) 81.25,14 78,17.25 59.11,17.25 U1.1
5V: length 344.9
  Top Layer w0.508: 85.4,45 79.5,45 72.23,52.27 72.23,55.71 ; 85.4,45 C27.1 87.4,41.85 88.75,40.5 CN5.2 ; 85.4,45 84.28,45 ; 55.66,12.73 55.8,12.87 55.8,17.61 C51.2 53.38,19.79 53.38,13.94 U1.4 53.11,11.25 51.5,11.25 50.75,12 50.75,19.16 C24.2 ; U1.2 58.75,14.35 58.75,17.5 66.5,17.5 68,19 68,21.5 69,22.5 R16.2
  Top Layer w0.762: 58.75,17.5 56.34,19.91 C51.2
  Top Layer w1.016: 19.75,19.91 20.23,20.39 20.23,25.56 20.95,26.28 ; 20.93,28.14 20.95,28.11 20.95,26.28 ; U6.10 U6.9 U6.8 72.23,55.71 ; 34.17,20.22 34.33,20.38 34.33,24.58 33.05,25.86 33.05,27.3 ; 20.95,26.28 20.99,26.32 ; 11.41,19.82 C14.2 ; 45.1,28.21 45.1,26.31 44.75,25.95 44.75,20.14 ; U1.2 U1.4
  Top Layer w2.032: C14.2 C2.2 C15.2 C16.2 C17.2 C18.2 C20.2 C19.2 C21.2 C23.2 C22.2 C24.2 C51.2
  Top Layer w2.54: C25.1 11.66,54.1 ; 11.66,54.1 11.66,42.1 ; 11.66,54.1 C28.1 C31.1 C34.1 C50.1 60.45,54.1 66.07,59.72 ; C4.1 55.73,42.1 C49.1 C35.1 C32.1 C30.1 11.66,42.1 ; 11.66,42.1 11.66,31.07 12.6,30.13 14.97,30.13 C29.1 C33.1 C48.1 ; 11.66,42.1 C26.1
GND:
  vias: v3(3,50) v3(3.94,26.5) v3(4.32,37.9) v3(4.46,50) v3(5.21,26.5) v3(5.59,37.9) v3(6.48,26.5) v3(6.86,37.9) v3(6.99,50) v3(7.75,26.5) v3(8.13,37.9) v3(18.29,63.55) v3(19.56,63.55) v3(20.83,63.55) v3(22.1,63.55) v3(24.89,49.84) v3(25.19,37.75) v3(26.16,49.84) v3(26.44,17.75) v3(26.46,37.75) v3(27.43,49.84) v3(27.73,37.75) v3(27.71,17.75) v3(28.7,49.84) v3(29,37.75) v3(28.98,17.75) v3(30.25,17.75) v3(32.5,22.5) v3(36,22.5) v3(37.34,27.23) v3(37.34,26.22) v3(38.61,27.23) v3(38.61,26.22) v3(39.88,27.23) v3(39.88,26.22) v3(41.15,27.23) v3(41.15,26.22) v3(42.42,63.3) v3(43.69,63.3) v3(44.96,63.3) v3(46.23,63.3) v3(48.26,26.22) v3(49.53,26.22) v3(50.8,26.22) v3(52.07,26.22) v3(58.67,25.96) v3(59.94,25.96) v3(60.76,43.22) v3(61.04,50.86) v3(61.21,25.96) v3(62.03,43.22) v3(61.98,9.2) v3(62.31,50.86) v3(62.48,25.96) v3(63.25,9.2) v3(63.3,43.22) v3(63.58,50.86) v3(64.52,9.2) v3(64.57,43.22) v3(64.85,50.86) v3(65.79,9.2) v3(66,15) v3(66,13.25) v3(66,12.25) v3(67.25,13.25) v3(71.88,35.11) v3(72.25,47.25) v3(73.15,35.11) v3(73.49,10.04) v3(74.42,35.11) v3(75.25,28) v3(75.25,26) v3(75.55,54.33) v3(75.69,35.11) v3(76.82,54.33) v3(78,43) v3(78.09,54.33) v3(78.75,28) v3(78.75,26) v3(79.36,54.33) v3(80,33) v3(80.25,43) v3(80.75,35) v3(81.75,37) v3(81.75,12.25) v3(81.75,9.75) v3(81.86,47.25) v3(82,39) v3(82.75,43) v3(84.5,43) v3(86.75,13.25)
VBUS: length 146.6
  Top Layer w0.508: 88.1,8.75 84.16,8.75 v3(83.87,9.05) ; 88.1,3.95 84.59,3.95 83.87,4.68 v3(83.87,5.74)
  Top Layer w1.016: C45.2 61.59,22.5 C38.1 C37.1 68.25,24.25 U6.1 ; 87,48.09 86.81,48.28 86.81,54.31 87.83,55.33 C44.1 C52.1 ; 87,48.09 89.59,48.09 X1.2 ; 87,48.09 87.09,48 ; C41.1 61.73,28.83 v3(63,30.1) 66.1,27 U6.1 ; U6.1 U6.2 71.75,24.98 72.44,24.29 74.46,24.29 ; 74.46,24.29 R4.2 R17.2 ; 74.46,24.29 78.33,24.29 79.35,23.27 R3.2 81.09,22.49 82,21.58 82,17.5 83.87,15.63 v3(83.87,9.05) ; C52.1 C53.1 ; C52.1 87.58,64.75 C43.1 C55.1 C54.1
  Bottom Layer w0.508: v3(83.87,5.74) v3(83.87,9.05)
  Bottom Layer w1.016: X1.2 86.25,44.75 77.65,44.75 v3(63.57,30.67) v3(63,30.1)
(no net):
  vias: v1(4,63) v1(4,14) v1(62,63) v1(62,14) v2(70.5,72.5) v2(70.5,4.5)
IO5: length 82.6
  Top Layer w0.254: CN5.6 89.5,35.5 88.75,34.75 v4(88.75,34.25) 88.25,33.75 R6.1
  Bottom Layer w0.203: U1.29 21.57,20.32 25.07,23.82 68.64,23.82 76.32,31.5 86,31.5 v4(88.75,34.25)
IO6: length 85.3
  Top Layer w0.254: R7.1 88,35.75 v4(88.58,36.33) 89,36.75 CN5.5
  Bottom Layer w0.203: U1.31 19.03,20.53 22.83,24.33 68.32,24.33 78,34 86.25,34 v4(88.58,36.33)
IO12: length 84.6
  Top Layer w0.254: R18.1 v4(89.3,31.75) 90.55,33 CN5.7
  Bottom Layer w0.203: v4(89.3,31.75) 87.8,30.25 75.75,30.25 68.75,23.25 29.25,23.25 22.75,16.75 22.75,14.75 22,14 20.3,14 U1.32
IO16: length 91.3
  Top Layer w0.254: CN5.4 89,38 v4(88.75,37.75) R8.1
  Bottom Layer w0.203: v4(88.75,37.75) 87.75,37.75 86,36 78.93,36 67.68,24.75 21.75,24.75 15.25,18.25 15.25,14.03 U1.36
IO17: length 51
  Top Layer w0.254: R15.1 87.12,17.38 v4(88.78,17.38) CN4.8
  Bottom Layer w0.203: 87.02,17.48 R15.1 ; 87.02,17.48 86.77,17.48 86.75,17.5 86.73,17.48 80.52,17.48 78,20 49.16,20 U1.11 ; 87.02,17.48 88.75,17.48
IO22: length 57.5
  Top Layer w0.254: CN4.5 89.38,21.12 v4(88.66,21.84) R11.1
  Bottom Layer w0.203: U1.15 39.35,16.85 44,21.5 88.31,21.5 v4(88.66,21.84)
IO23: length 59.2
  Top Layer w0.254: R10.1 87.75,21.5 v4(88.71,20.54) 89.37,19.88 CN4.6
  Bottom Layer w0.203: v4(88.71,20.54) 86.71,20.54 86.25,21 44.25,21 40.4,17.15 40.4,13.78 U1.16
IO24: length 65.7
  Top Layer w0.254: CN4.4 89.38,22.38 88.5,23.25 v4(88.5,23.75) 88.5,25 88,25.5 R12.1
  Bottom Layer w0.203: U1.18 38,13.92 38,20 40.25,22.25 69.25,22.25 70.75,23.75 v4(88.5,23.75)
IO25: length 71.8
  Top Layer w0.254: R13.1 88,27.5 v4(89,26.5) 89,24.25 89.63,23.62 CN4.3
  Bottom Layer w0.203: v4(89,26.5) 88.5,27 73.25,27 69,22.75 38.5,22.75 33,17.25 33,14 U1.22
IO26: length 91
  Top Layer w0.254: CN5.3 v4(88.75,39.25) 88.25,39.75 R9.1
  Bottom Layer w0.203: v4(88.75,39.25) 87.25,39.25 86,38 79.75,38 67,25.25 21.39,25.25 U1.37
IO27: length 55.4
  Top Layer w0.254: CN4.7 v4(89,18.63) 88.13,19.5 R14.1
  Bottom Layer w0.203: v4(89,18.63) 86.62,18.63 84.75,20.5 44.75,20.5 41.89,17.64 U1.13
SCL: length 54.2
  Top Layer w0.203: v3(92.25,24.75) 92.13,24.87 CN4.2
  Bottom Layer w0.203: U1.5 52.05,17.3 54.25,19.5 77.5,19.5 81.01,15.99 90.74,15.99 92.25,17.5 v3(92.25,24.75)
SDA: length 54.5
  Top Layer w0.203: v3(93,26) 92.88,26.12 CN4.1
  Bottom Layer w0.203: v3(93,26) 93,17.52 90.75,15.27 80.98,15.27 77.25,19 56.5,19 54.59,17.09 U1.3
$1N3108: length 19.2
  Top Layer w0.762: U2.1 80.5,15.52 79.25,16.77 75.79,16.77 ; 75.79,16.77 74.47,18.09 74.47,20.49 ; 75.79,16.77 73.5,14.47 C39.1 C40.1
$1N3157: length 14
  Top Layer w0.254: U2.6 76.5,6.81 77.36,5.95 81.64,5.95 83.79,8.1 88.1,8.1
$1N3186: length 20.3
  Top Layer w0.254: R3.1 80.75,19.09 80.75,17.5 83,15.25 83,8 81.5,6.5 79,6.5 78.5,7 U2.8
$1N3548: length 19.2
  Top Layer w0.254: U2.9 79.5,7 79.59,6.91 81.16,6.91 82.5,8.25 82.5,15 82.35,15.15 82.25,15.15 R5.2
$1N3577: length 19.8
  Top Layer w0.254: v3(77.52,15.34) 77.52,14.02 U2.4 ; v3(85.55,5.74) 86.28,5.74 86.64,6.1 88.1,6.1
  Bottom Layer w0.254: v3(85.55,5.74) 85.55,12.2 84.75,13 81.25,13 78.91,15.34 v3(77.52,15.34)
$1N10235: length 22.2
  Top Layer w0.254: LED1.1 71.95,8.25 68.97,8.25 68.28,8.94 68.28,16.31 69.65,17.69 R16.1
$1N10369: length 25.3
  Top Layer w0.254: R17.1 72,19.07 68.94,16 68.94,9.23 69.41,8.75 72.38,8.75 76.2,4.93 78.42,4.93 LED2.1
$1N10886: length 12.4
  Top Layer w0.254: v3(84.99,5.1) 88.1,5.1 ; v3(77.88,6.66) 77.5,7.03 U2.7
  Bottom Layer w0.254: v3(84.99,5.1) 79.43,5.1 v3(77.88,6.66)
$1N10969: length 22.2
  Top Layer w0.254: U2.5 75.46,14 75.29,13.83 75.29,6.86 76.81,5.34 82.11,5.34 83.38,6.6 88.1,6.6

## Copper pours and planes (outline as drawn; the poured copper is in the pictures)
GND on Top Layer: -1.75,66.62 -1.75,7.18 -0.93,6.36 53.28,6.36 62.27,-2.62 62.27,-6.6 99.69,-6.6 102.63,-3.65 102.63,78.55 103.67,79.58 11.21,79.58
GND on Bottom Layer: -6.8,68.73 -6.8,-0.51 1.89,-9.2 97.06,-9.2 104.42,-1.83 104.42,81.4 101.33,84.5 8.96,84.5

Small or netless copper shapes (teardrops, artwork), in the pictures only: 152 on Top Layer, 32 on Bottom Layer

## Text on the board
Top Silkscreen Layer: VbusIN | 5V | VBUS | Under Supervision of Shuyu / --2025.4.19
